# Altium project Power_Detect.PrjPcb
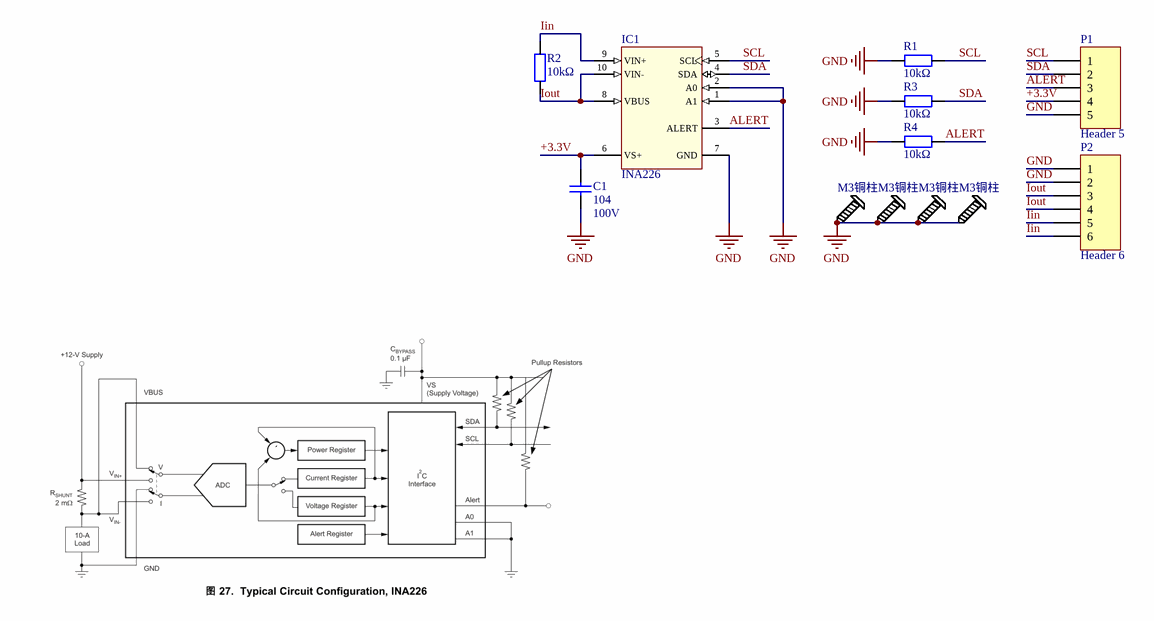
[diagram p0: Power_Detect.SchDoc]
1 sheet, 12 parts. Net scope: global (net labels, ports and power ports of the same name join across sheets).
Board file: Power_Detect.PcbDoc

## Sheet Power_Detect.SchDoc
size A4; ApprovedBy: 阳光电路; CheckedBy: 阳光电路; Author: 阳光电路; CompanyName: 阳光电路; DrawnBy: 阳光电路; Engineer: 阳光电路; Organization: 阳光电路; Address1: 中国; Address2: 桂林; Address3: 阳朔; Address4: 中国 2021; SheetNumber: 1; SheetTotal: 1

### Parts
C1  voltage: 100V  [C0603]  (hidden comment: 叠层陶瓷电容)
IC1  INA226  [MSOP-10]
P1  Header 5  [HDR1X5]
P2  Header 6  [HDR1X6]
R1  贴片电阻  [R0603]  (value not drawn)
R2  贴片电阻  [R2512]  (value not drawn)
R3  贴片电阻  [R0603]  (value not drawn)
R4  贴片电阻  [R0603]  (value not drawn)
S1  M3铜柱  [M3]
S2  M3铜柱  [M3]
S3  M3铜柱  [M3]
S4  M3铜柱  [M3]

### Nets
GND: C1.1 IC1.1(A1) IC1.2(A0) IC1.7(GND) P1.5 P2.1 P2.2 R1.1 R3.1 R4.1 S1.1(GND) S2.1(GND) S3.1(GND) S4.1(GND)
+3.3V: C1.2 IC1.6(VS+) P1.4
ALERT: IC1.3(ALERT) P1.3 R4.2
Iin: IC1.9(VIN+) P2.5 P2.6 R2.2
Iout: IC1.8(VBUS) IC1.10(VIN-) P2.3 P2.4 R2.1
SCL: IC1.5(SCL) P1.1 R1.2
SDA: IC1.4(SDA) P1.2 R3.2

### Notes on the sheet
- Title
- DrawnBy:
- Size:
- Date:
- A4
- Number:
- Time:
- Revision:
- Sheet
- of
- File:

### Library data of the parts
C1 = 104: 无极性电容; type: 0805; capacity: 104
IC1 = INA226: 电压电流功率监测
P1 = Header 5: Header, 5-Pin; LatestRevisionDate: 17-Jul-2002; LatestRevisionNote: Re-released for DXP Platform.; Publisher: Altium Limited
P2 = Header 6: Header, 6-Pin; LatestRevisionDate: 17-Jul-2002; LatestRevisionNote: Re-released for DXP Platform.; Publisher: Altium Limited
R1-R4 = 10kΩ: 贴片/直插电阻; package: 0805; resistance: 10kΩ